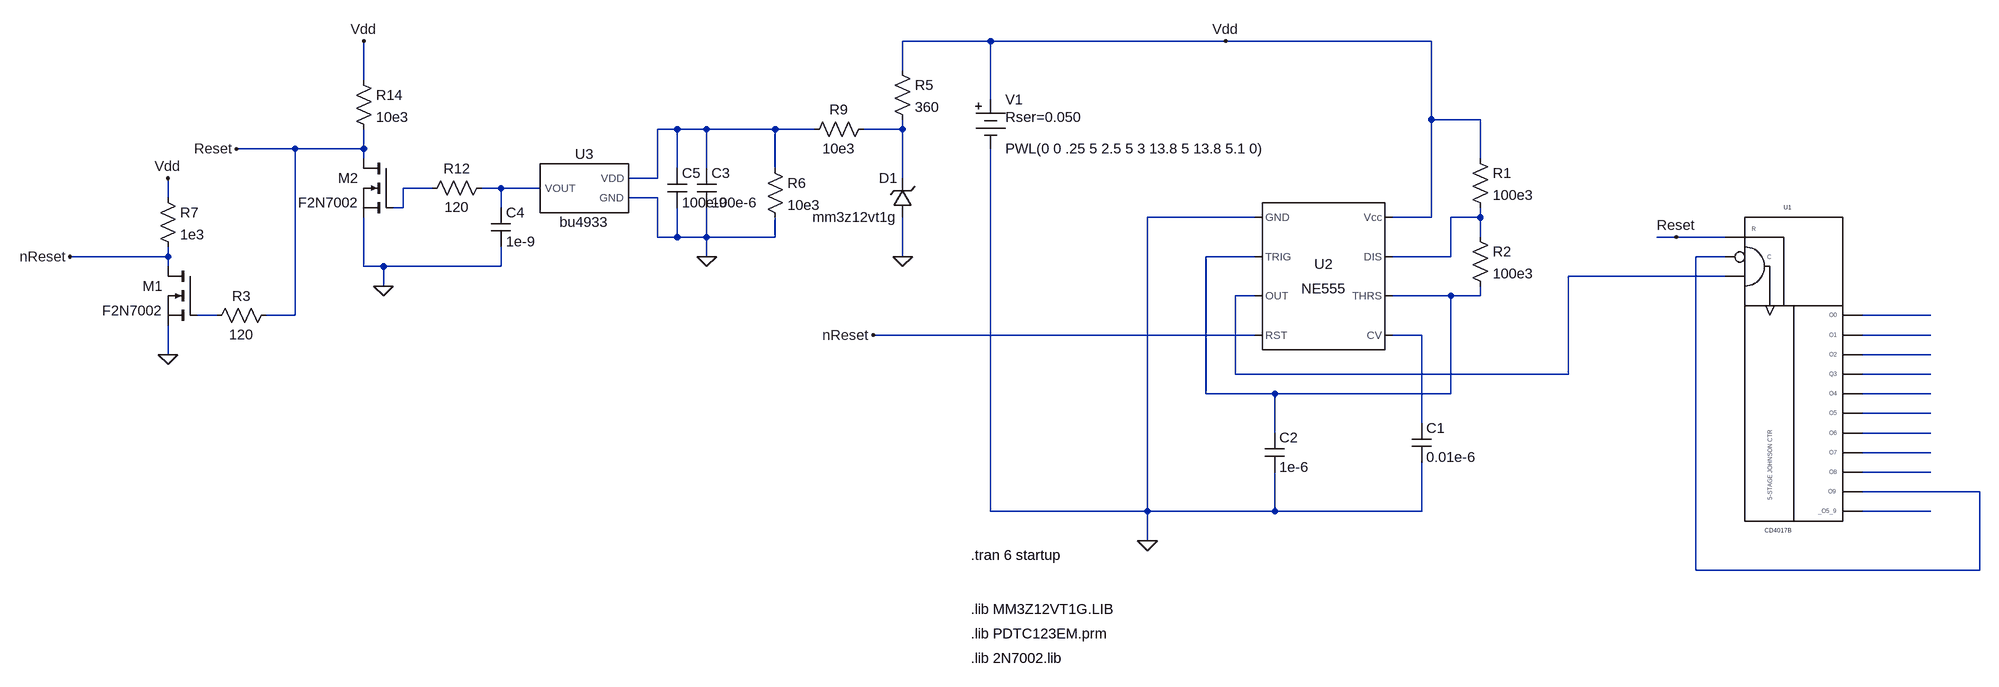
[diagram p0: schematic LockSequencer-2.asc]
LockSequencer-2.asc, the LTspice schematic file:
Version 4
SHEET 1 960 688
WIRE -1088 -336 -1232 -336
WIRE -704 -336 -1088 -336
WIRE -368 -336 -704 -336
WIRE -1232 -288 -1232 -336
WIRE -2112 -272 -2112 -336
WIRE -1088 -240 -1088 -336
WIRE -368 -208 -368 -336
WIRE -288 -208 -368 -208
WIRE -1600 -192 -1632 -192
WIRE -1552 -192 -1600 -192
WIRE -1440 -192 -1552 -192
WIRE -1376 -192 -1440 -192
WIRE -1232 -192 -1232 -208
WIRE -1232 -192 -1296 -192
WIRE -2224 -160 -2320 -160
WIRE -2112 -160 -2112 -192
WIRE -2112 -160 -2224 -160
WIRE -2112 -144 -2112 -160
WIRE -288 -144 -288 -208
WIRE -1600 -128 -1600 -192
WIRE -1552 -128 -1552 -192
WIRE -1440 -128 -1440 -192
WIRE -1632 -112 -1632 -192
WIRE -1632 -112 -1680 -112
WIRE -1232 -112 -1232 -192
WIRE -2000 -96 -2048 -96
WIRE -1888 -96 -1920 -96
WIRE -1824 -96 -1888 -96
WIRE -2432 -80 -2432 -112
WIRE -1632 -80 -1680 -80
WIRE -2048 -64 -2048 -96
WIRE -2048 -64 -2064 -64
WIRE -1888 -64 -1888 -96
WIRE -656 -48 -832 -48
WIRE -368 -48 -368 -208
WIRE -368 -48 -432 -48
WIRE -288 -48 -288 -64
WIRE -288 -48 -336 -48
WIRE -1632 -16 -1632 -80
WIRE -1600 -16 -1600 -64
WIRE -1600 -16 -1632 -16
WIRE -1552 -16 -1552 -64
WIRE -1552 -16 -1600 -16
WIRE -1440 -16 -1440 -48
WIRE -1440 -16 -1552 -16
WIRE -288 -16 -288 -48
WIRE 32 -16 0 -16
WIRE 112 -16 32 -16
WIRE -2432 16 -2432 0
WIRE -2432 16 -2592 16
WIRE -1552 16 -1552 -16
WIRE -1232 16 -1232 -48
WIRE -656 16 -736 16
WIRE -336 16 -336 -48
WIRE -336 16 -432 16
WIRE 112 16 64 16
WIRE -2432 32 -2432 16
WIRE -2112 32 -2112 -48
WIRE -2080 32 -2112 32
WIRE -1888 32 -1888 0
WIRE -1888 32 -2080 32
WIRE 112 48 -144 48
WIRE -2080 64 -2080 32
WIRE -656 80 -688 80
WIRE -336 80 -432 80
WIRE -288 80 -288 64
WIRE -288 80 -336 80
WIRE -2352 112 -2384 112
WIRE -2224 112 -2224 -160
WIRE -2224 112 -2272 112
WIRE 448 112 336 112
WIRE -656 144 -1280 144
WIRE -384 144 -432 144
WIRE 448 144 336 144
WIRE -2432 176 -2432 128
WIRE 448 176 336 176
WIRE -688 208 -688 80
WIRE -144 208 -144 48
WIRE -144 208 -688 208
WIRE 448 208 336 208
WIRE -736 240 -736 16
WIRE -624 240 -736 240
WIRE -336 240 -336 80
WIRE -336 240 -624 240
WIRE 448 240 336 240
WIRE 448 272 336 272
WIRE -384 288 -384 144
WIRE -624 304 -624 240
WIRE 448 304 336 304
WIRE 448 336 336 336
WIRE 448 368 336 368
WIRE 528 400 336 400
WIRE -1088 432 -1088 -160
WIRE -832 432 -832 -48
WIRE -832 432 -1088 432
WIRE -624 432 -624 368
WIRE -624 432 -832 432
WIRE -384 432 -384 352
WIRE -384 432 -624 432
WIRE 448 432 336 432
WIRE -832 480 -832 432
WIRE 64 528 64 16
WIRE 528 528 528 400
WIRE 528 528 64 528
FLAG -832 480 0
FLAG -704 -336 Vdd
FLAG -1232 16 0
FLAG -1552 16 0
FLAG -2080 64 0
FLAG -2320 -160 Reset
FLAG 32 -16 Reset
FLAG -2432 -112 Vdd
FLAG -2112 -336 Vdd
FLAG -2592 16 nReset
FLAG -1280 144 nReset
FLAG -2432 176 0
SYMBOL Misc\\NE555 -544 48 R0
SYMATTR InstName U2
SYMBOL Misc\\battery -1088 -256 R0
WINDOW 123 0 0 Left 2
WINDOW 39 24 44 Left 2
SYMATTR SpiceLine Rser=0.050
SYMATTR InstName V1
SYMATTR Value PWL(0 0 .25 5 2.5 5 3 13.8 5 13.8 5.1 0)
SYMBOL cap -400 288 R0
SYMATTR InstName C1
SYMATTR Value 0.01e-6
SYMATTR SpiceLine V=16
SYMBOL cap -640 304 R0
SYMATTR InstName C2
SYMATTR Value 1e-6
SYMATTR SpiceLine V=16
SYMBOL res -304 -160 R0
SYMATTR InstName R1
SYMATTR Value 100e3
SYMBOL res -304 -32 R0
SYMATTR InstName R2
SYMATTR Value 100e3
SYMBOL Dig_Add\\cd4017b 224 -80 R0
SYMATTR InstName U1
SYMATTR SpiceLine VDD=13.1  SPEED=1.0  TRIPDT=5e-9
SYMBOL zener -1216 -48 R180
WINDOW 0 24 64 Left 2
WINDOW 3 24 0 Left 2
SYMATTR InstName D1
SYMATTR Value mm3z12vt1g
SYMATTR Prefix X
SYMBOL res -1248 -304 R0
SYMATTR InstName R5
SYMATTR Value 360
SYMBOL cap -1568 -128 R0
SYMATTR InstName C3
SYMATTR Value 100e-6
SYMATTR SpiceLine V=16
SYMBOL cap -1904 -64 R0
SYMATTR InstName C4
SYMATTR Value 1e-9
SYMATTR SpiceLine V=16
SYMBOL res -1456 -144 R0
SYMATTR InstName R6
SYMATTR Value 10e3
SYMBOL res -1280 -208 R90
WINDOW 0 0 56 VBottom 2
WINDOW 3 32 56 VTop 2
SYMATTR InstName R9
SYMATTR Value 10e3
SYMBOL AutoGenerated\\bu4933 -1760 -96 R0
SYMATTR InstName U3
SYMBOL res -1904 -112 R90
WINDOW 0 0 56 VBottom 2
WINDOW 3 32 56 VTop 2
SYMATTR InstName R12
SYMATTR Value 120
SYMBOL res -2128 -288 R0
SYMATTR InstName R14
SYMATTR Value 10e3
SYMBOL nmos -2064 -144 M0
SYMATTR InstName M2
SYMATTR Value F2N7002
SYMATTR Prefix X
SYMBOL nmos -2384 32 M0
SYMATTR InstName M1
SYMATTR Value F2N7002
SYMATTR Prefix X
SYMBOL res -2256 96 R90
WINDOW 0 0 56 VBottom 2
WINDOW 3 32 56 VTop 2
SYMATTR InstName R3
SYMATTR Value 120
SYMBOL res -2448 -96 R0
SYMATTR InstName R7
SYMATTR Value 1e3
SYMBOL cap -1616 -128 R0
SYMATTR InstName C5
SYMATTR Value 100e-9
SYMATTR SpiceLine V=16
TEXT -1120 504 Left 2 !.tran 6 startup
TEXT -1120 592 Left 2 !.lib MM3Z12VT1G.LIB
TEXT -1120 632 Left 2 !.lib PDTC123EM.prm
TEXT -1120 672 Left 2 !.lib 2N7002.lib

The netlist it stands for:
* LockSequencer-2.asc
XU2 0 N006 N008 nReset N011 N006 N005 Vdd NE555  ; pins GND TRIG OUT RST CV THRS DIS Vcc
V1 Vdd 0 PWL(0 0 .25 5 2.5 5 3 13.8 5 13.8 5.1 0) Rser=0.050
C1 N011 0 0.01e-6 V=16
C2 N006 0 1e-6 V=16
R1 Vdd N005 100e3
R2 N005 N006 100e3
XU1 Reset N007 N008 N010 N012 N013 N014 N015 N016 N017 N018 N019 N007 N020 VDD 0 CD4017B VDD=13.1  SPEED=1.0  TRIPDT=5e-9  ; pins MR CPN CP Q0 Q1 Q2 Q3 Q4 Q5 Q6 Q7 Q8 Q9 Q59
XD1 0 N002 mm3z12vt1g  ; pins + -
R5 Vdd N002 360
C3 N001 0 100e-6 V=16
C4 N004 0 1e-9 V=16
R6 N001 0 10e3
R9 N002 N001 10e3
XU3 N004 N001 0 bu4933  ; pins VOUT VDD GND
R12 N004 N003 120
R14 Vdd Reset 10e3
XM2 Reset N003 0 F2N7002  ; pins D G S
XM1 nReset N009 0 F2N7002  ; pins D G S
R3 Reset N009 120
R7 Vdd nReset 1e3
C5 N001 0 100e-9 V=16
.tran 6 startup
.lib MM3Z12VT1G.LIB
.lib PDTC123EM.prm
.lib 2N7002.lib
.lib NE555.sub
.lib cd4000.lib
.lib BU4933.LIB
.backanno
.end